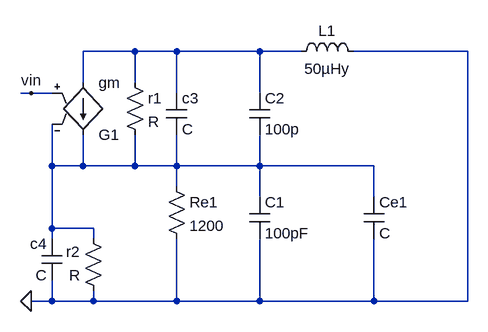
[diagram p0: schematic Collpits_e.asc]
Collpits_e.asc, the LTspice schematic file:
Version 4
SHEET 1 880 680
WIRE -32 -16 -112 -16
WIRE 32 -16 -32 -16
WIRE 160 -16 32 -16
WIRE 224 -16 160 -16
WIRE 480 -16 304 -16
WIRE -112 32 -112 -16
WIRE -32 32 -32 -16
WIRE -192 48 -208 48
WIRE -160 48 -192 48
WIRE 32 48 32 -16
WIRE 160 48 160 -16
WIRE -160 160 -160 96
WIRE -112 160 -112 112
WIRE -112 160 -160 160
WIRE -32 160 -32 112
WIRE -32 160 -112 160
WIRE 32 160 32 112
WIRE 32 160 -32 160
WIRE 160 160 160 112
WIRE 160 160 32 160
WIRE 336 160 160 160
WIRE 32 192 32 160
WIRE 160 208 160 160
WIRE 336 208 336 160
WIRE -160 256 -160 160
WIRE -96 256 -160 256
WIRE -160 272 -160 256
WIRE -96 272 -96 256
WIRE -160 368 -160 336
WIRE -160 368 -192 368
WIRE -96 368 -96 352
WIRE -96 368 -160 368
WIRE 32 368 32 272
WIRE 32 368 -96 368
WIRE 160 368 160 272
WIRE 160 368 32 368
WIRE 336 368 336 272
WIRE 336 368 160 368
WIRE 480 368 480 -16
WIRE 480 368 336 368
FLAG -192 368 0
FLAG -192 48 vin
SYMBOL ind 208 0 R270
WINDOW 0 32 56 VTop 2
WINDOW 3 5 56 VBottom 2
SYMATTR InstName L1
SYMATTR Value 50µHy
SYMBOL res 16 176 R0
SYMATTR InstName Re1
SYMATTR Value 1200
SYMBOL cap 144 208 R0
SYMATTR InstName C1
SYMATTR Value 100pF
SYMBOL cap 144 48 R0
SYMATTR InstName C2
SYMATTR Value 100p
SYMBOL cap 320 208 R0
SYMATTR InstName Ce1
SYMBOL cap 16 48 R0
SYMATTR InstName c3
SYMBOL res -48 16 R0
SYMATTR InstName r1
SYMBOL g2 -112 128 M180
SYMATTR InstName G1
SYMATTR Value gm
SYMBOL cap -144 336 R180
WINDOW 0 24 56 Left 2
WINDOW 3 24 8 Left 2
SYMATTR InstName c4
SYMBOL res -80 368 R180
WINDOW 0 36 76 Left 2
WINDOW 3 36 40 Left 2
SYMATTR InstName r2

The netlist it stands for:
* Collpits_e.asc
L1 N001 0 50µHy
Re1 N002 0 1200
C1 N002 0 100pF
C2 N001 N002 100p
Ce1 N002 0 C
c3 N001 N002 C
r1 N001 N002 R
G1 N001 N002 vin N002 gm
c4 0 N002 C
r2 0 N002 R
.backanno
.end